# EasyEDA Pro project RM2025_超级电容控制器_IMCA.eprj, board 超电V2.3_1
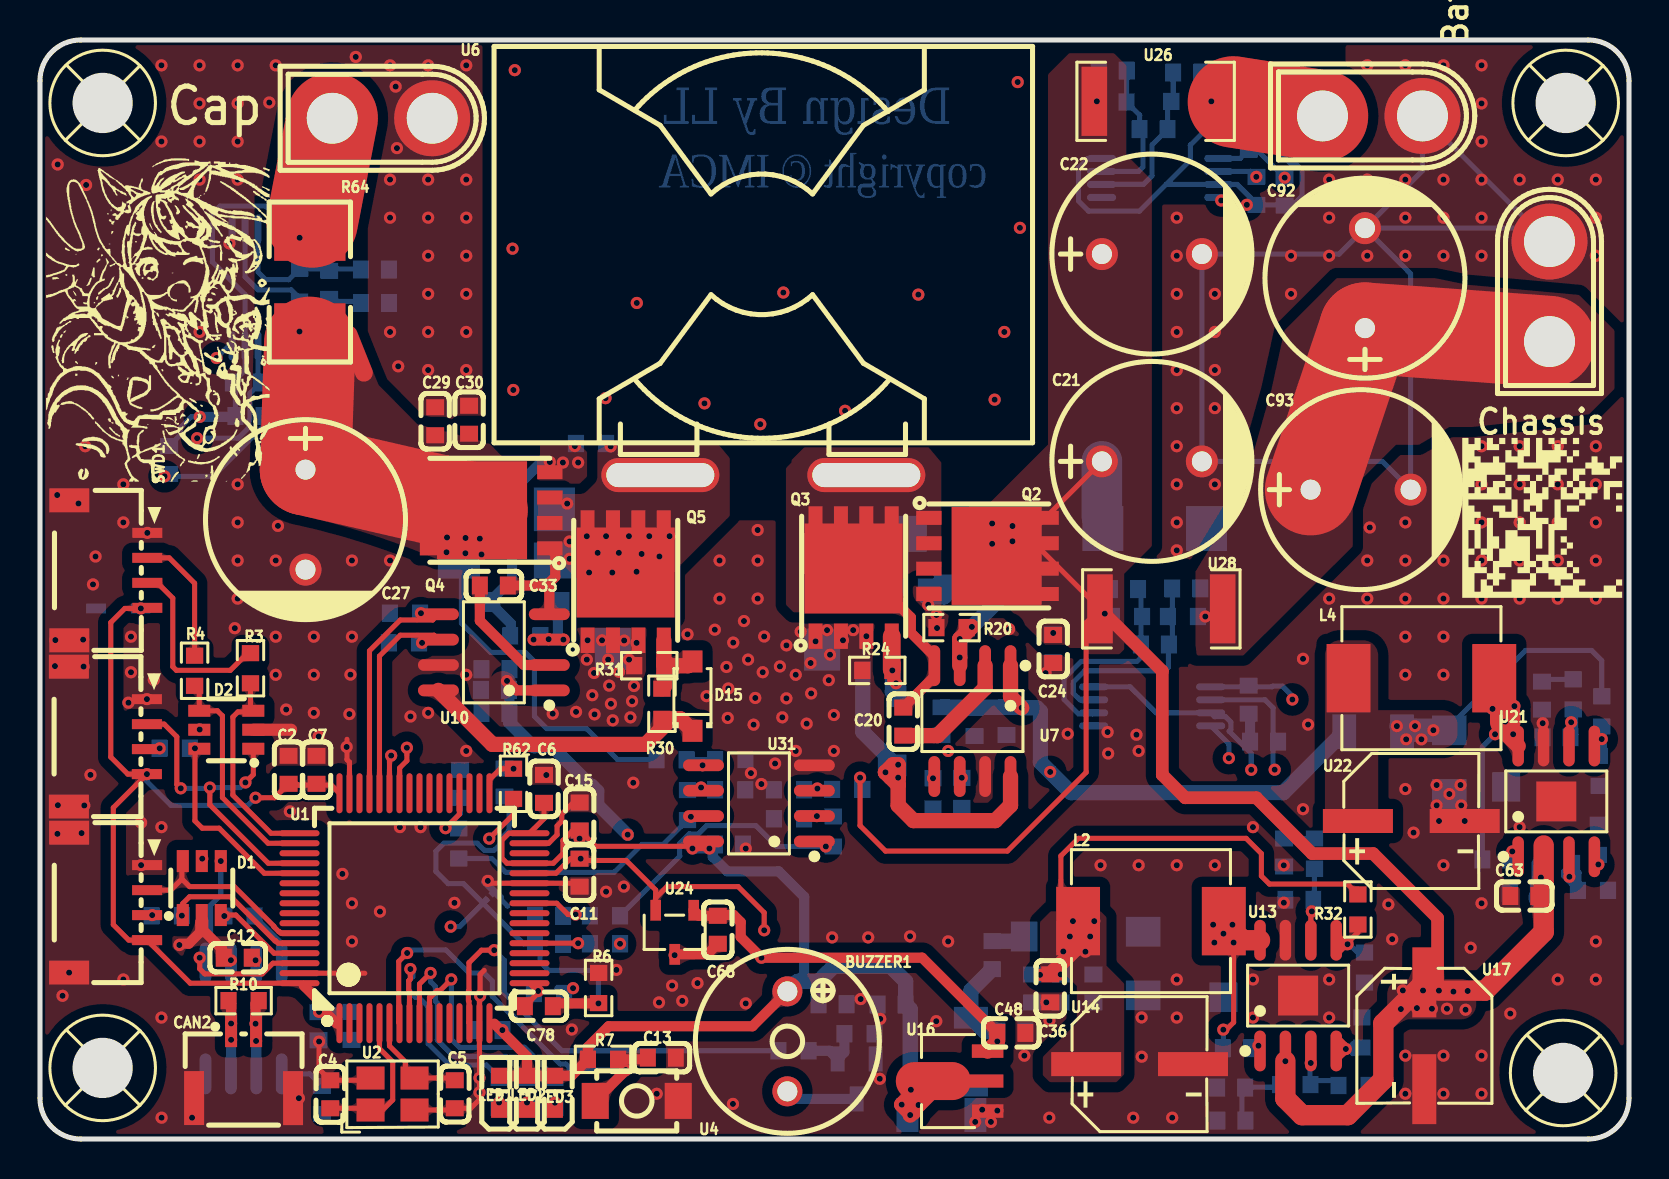
[diagram p5: board, top side]
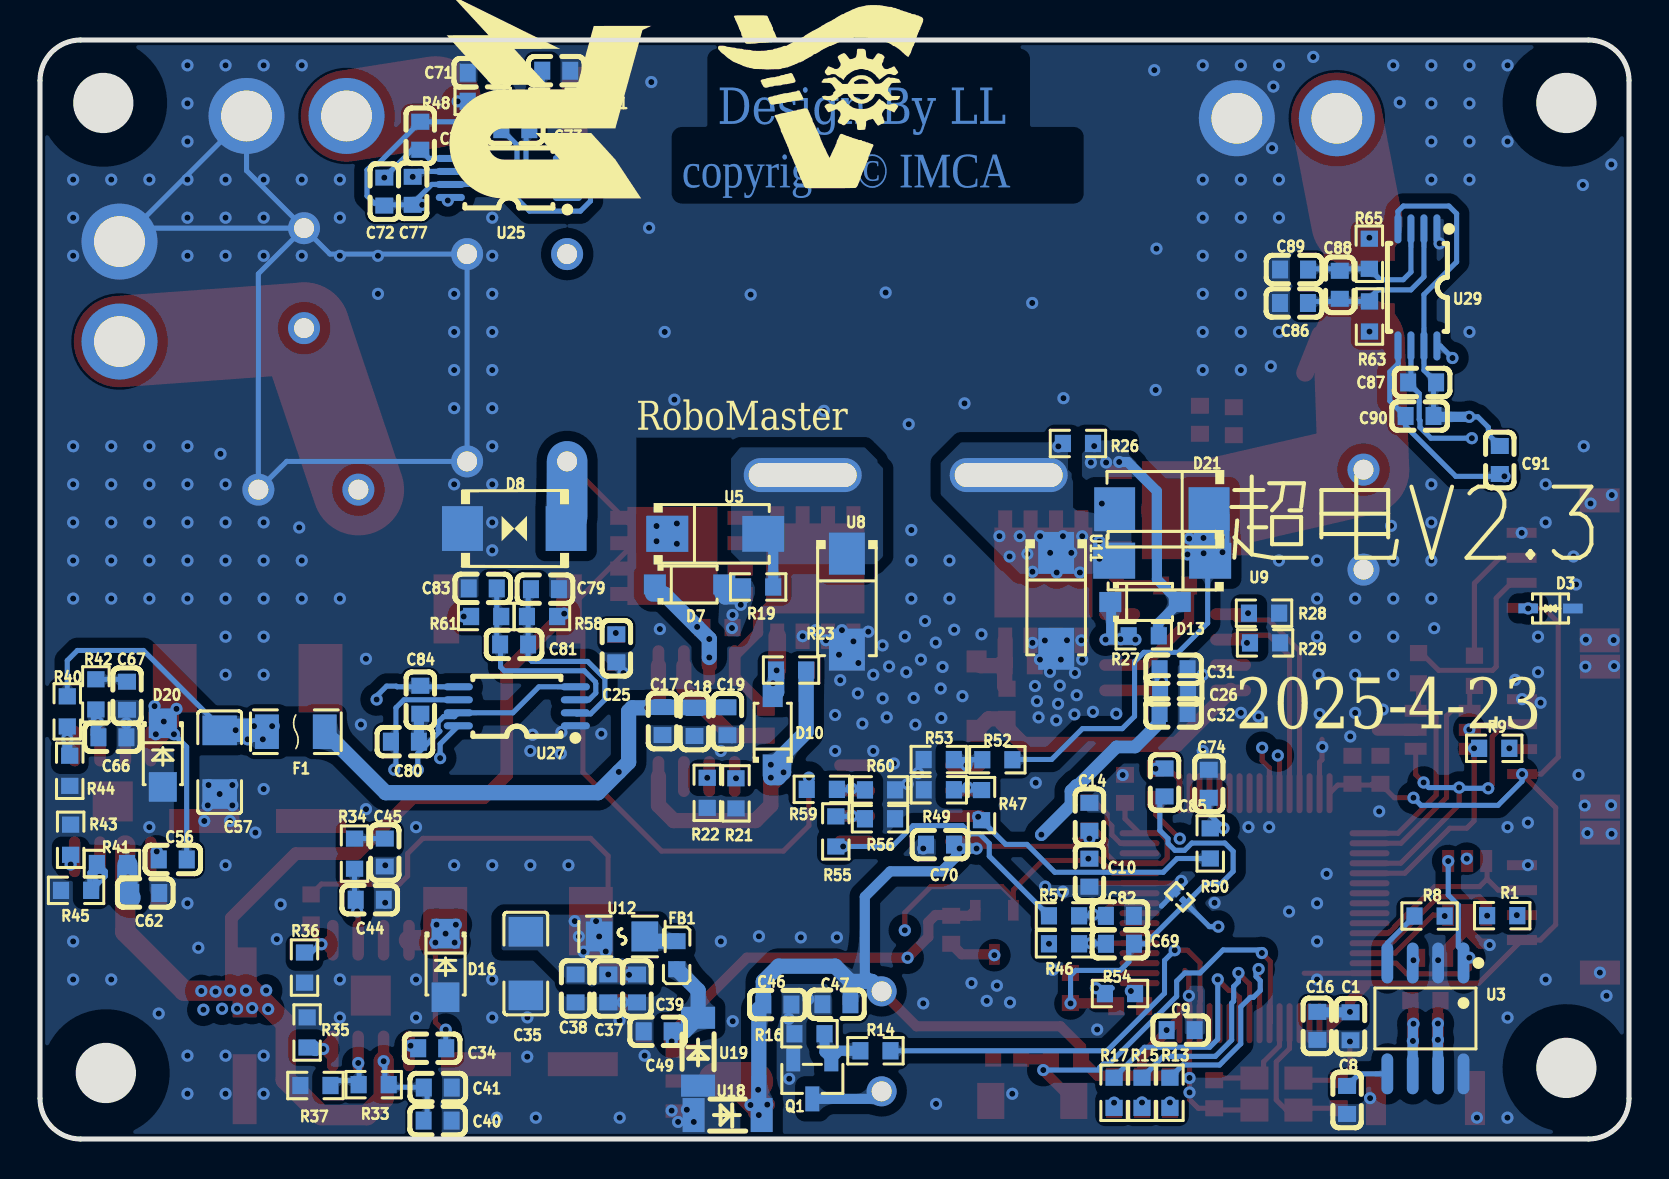
[diagram p6: board, bottom side, seen from below]

Outline 79.45 x 54.97 mm; copper layers: Top Layer, Inner1, Inner2, Bottom Layer. Coordinates in mm from the lower left corner of the outline.
Outline path: 0,52.93 0,2.03 arc(0.6,0.6) 2.03,0 77.42,0 arc(78.86,0.6) 79.45,2.03 79.45,52.93 arc(78.86,54.37) 77.42,54.97 2.03,54.97 arc(0.6,54.37) 0,52.93
Stack: Top Layer 0.035mm 外层铜厚1oz / Dielectric1 0.2104mm 7628 RC49% 8.6mil / Inner1 0.0152mm 内层铜厚 / Dielectric2 1.065mm 1.1mm H/HOZ Copper / Inner2 0.0152mm 内层铜厚 / Dielectric3 0.2104mm 7628 RC49% 8.6mil / Bottom Layer 0.035mm 外层铜厚1oz

## Design rules (mm)
template: 自定义配置
spacing safeClearance (default): track to track 0.152, other pairs 0.152 to 0.3
track width trackWidth (default): min 0.102, default 0.254, max 254
differential pair differentialPair (default): width min 0.127, default 0.254, max 2.54; gap min 0.152, default 0.152
via viaSize (default): diameter min 0.5, default 0.61, max 10; hole min 0.249, default 0.305, max 5.999

## Placement (name value [footprint] x y rotation side)
Battery  XT30U-M  [CONN-TH_XT30U-M]  66.62 51.17 0 top
BUZZER1  -  [BUZ-TH_BD9.0-P5.00-D0.6-L-FD]  37.37 4.88 270 top
C1  100nF  [C0603]  13.92 5.64 90 bottom
C2  100nF  [C0603]  12.43 18.47 270 top
C4  10pF  [C0603]  14.52 2.24 90 top
C5  10pF  [C0603]  20.74 2.24 270 top
C6  100nF  [C0603]  25.2 17.51 270 top
C7  100nF  [C0603]  13.83 18.47 270 top
C8  100nF  [C0603]  14.1 1.95 270 bottom
C9  100nF  [C0603]  22.42 5.45 0 bottom
C10  1uF  [C0603]  26.98 13.32 270 bottom
C11  100nF  [C0603]  26.98 13.32 270 top
C12  100nF  [C0603]  9.89 9.07 0 top
C13  100nF  [C0603]  31.09 4.07 180 top
C14  1uF  [C0603]  26.98 16.11 90 bottom
C15  100nF  [C0603]  26.98 16.13 90 top
C16  100nF  [C0603]  15.58 5.66 90 bottom
C17  10uF  [C0603]  48.33 20.9 90 bottom
C18  1uF  [C0603]  46.73 20.86 90 bottom
C19  100nF  [C0603]  45.08 20.89 90 bottom
C20  100nF  [C0603]  43.16 20.88 270 top
C21  50V 470uF  [CAP-TH_BD10.0-P5.00-D0.6-FD-A]  55.6 33.89 0 top
C22  50V 470uF  [CAP-TH_BD10.0-P5.00-D0.6-FD-A]  55.6 44.26 0 top
C24  10uF  [C0603]  50.66 24.51 90 top
C25  10uF  [C0603]  50.63 24.54 90 bottom
C26  10uF  [C0603]  22.75 22.46 0 bottom
C27  50V 470uF  [CAP-TH_BD10.0-P5.00-D0.6-FD-A]  13.28 30.98 270 top
C29  10uF  [C0603]  19.76 35.9 270 top
C30  10uF  [C0603]  21.45 35.97 270 top
C31  1uF  [C0603]  22.77 23.49 0 bottom
C32  100nF  [C0603]  22.77 21.31 0 bottom
C33  100nF  [C0603]  22.69 27.68 180 top
C34  100nF  [C0603]  59.84 4.54 180 bottom
C35  -  [C1206]  55.16 8.77 90 bottom
C36  10uF  [C0603]  50.51 7.53 90 top
C37  1uF  [C0603]  51.04 7.53 90 bottom
C38  2.2uF  [C0603]  52.67 7.53 90 bottom
C39  100nF  [C0603]  49.6 7.53 90 bottom
C40  10uF  [C0603]  59.57 0.92 0 bottom
C41  1uF  [C0603]  59.56 2.57 0 bottom
C44  47pF  [C0603]  62.97 11.97 0 bottom
C45  4700pF=4.7nF  [C0603]  62.21 14.33 90 bottom
C46  100nF  [C0603]  42.58 6.72 0 bottom
C47  1uF  [C0603]  39.63 6.74 180 bottom
C48  100nF  [C0603]  48.57 5.31 180 top
C49  10uF  [C0603]  48.57 5.39 180 bottom
C56  100nF  [C0603]  72.82 13.98 180 bottom
C57  -  [C1206]  70.47 18.85 90 bottom
C62  10uF  [C0603]  74.19 12.3 0 bottom
C63  1uF  [C0603]  74.22 12.15 0 top
C66  47pF  [C0603]  75.83 20.09 0 bottom
C67  4700pF=4.7nF  [C0603]  75.1 22.17 90 bottom
C68  100nF  [C0603]  33.89 10.46 90 top
C69  NC  [C0603]  25.45 9.76 180 bottom
C70  100nF  [C0603]  34.45 14.72 180 bottom
C71  NC  [C0603]  57.36 53.33 0 bottom
C72  100nF  [C0603]  60.82 47.42 270 bottom
C73  NC  [C0603]  55.69 50.51 0 bottom
C74  1nF  [C0603]  21.01 17.77 270 bottom
C75  NC  [C0603]  53.64 53.43 0 bottom
C76  100nF  [C0603]  60.44 50.18 270 bottom
C77  100nF  [C0603]  62.24 47.38 90 bottom
C78  NC  [C0603]  24.94 6.64 0 top
C79  NC  [C0603]  54.2 27.5 180 bottom
C80  100nF  [C0603]  61.21 19.87 180 bottom
C81  NC  [C0603]  55.75 24.73 180 bottom
C82  1nF  [C0603]  25.46 11.16 0 bottom
C83  NC  [C0603]  57.31 27.54 180 bottom
C84  100nF  [C0603]  60.44 21.97 90 bottom
C85  NC  [C0603]  23.22 17.83 270 bottom
C86  NC  [C0603]  16.75 41.81 0 bottom
C87  100nF  [C0603]  10.34 37.84 180 bottom
C88  NC  [C0603]  14.46 42.72 270 bottom
C89  NC  [C0603]  16.75 43.48 180 bottom
C90  100nF  [C0603]  10.47 36.16 0 bottom
C91  100nF  [C0603]  6.46 33.96 270 bottom
C92  50V 470uF  [CAP-TH_BD10.0-P5.00-D0.6-FD-A]  66.25 43.05 90 top
C93  50V 470uF  [CAP-TH_BD10.0-P5.00-D0.6-FD-A]  66.03 32.48 0 top
CAN2  -  [CONN-SMD_2P-P1.25_GH1.25-2P]  10.18 3.74 0 top
Cap  XT30U-M  [CONN-TH_XT30U-M]  17.11 51.05 0 top
Chassis  XT30U-M  [CONN-TH_XT30U-M]  75.48 42.38 90 top
D1  SRV05-4HTG-D  [SOT-23-6_L2.9-W1.6-P0.95-LS2.8-BR]  8.09 12.55 270 top
D2  SRV05-4HTG-D  [SOT-23-6_L2.9-W1.6-P0.95-LS2.8-BR]  9.32 20.47 0 top
D3  -  [SOD-323_L1.8-W1.3-LS2.5-BI]  3.92 26.53 0 bottom
D7  1N4148W  [SOD-123F_L2.7-W1.6-LS3.8-RD]  46.97 27.74 180 bottom
D8  SMBJ28CA  [SMB_L4.6-W3.6-LS5.3-BI]  55.74 30.53 180 bottom
D10  1N4148W  [SOD-123F_L2.7-W1.6-LS3.8-RD]  42.82 20.42 90 bottom
D13  1N4148W  [SOD-123F_L2.7-W1.6-LS3.8-RD]  24.2 26.86 180 bottom
D15  1N4148W  [SOD-123F_L2.7-W1.6-LS3.8-RD]  32.62 22.15 90 top
D16  DSK36  [SOD-123FL_L2.8-W1.8-LS3.7-R-RD]  59.17 8.68 270 bottom
D20  DSK36  [SOD-123FL_L2.8-W1.8-LS3.7-R-RD]  73.31 19.2 270 bottom
D21  SMBJ36A  [SMB_L4.6-W3.6-LS5.3-RD]  23.36 31.5 0 bottom
F1  BSMD1206-035-16V  [F1206]  66.66 20.37 180 bottom
FB1  GZ1608D601TF  [L0603]  47.61 9.19 90 bottom
GH1  U1  [CONN-SMD_4P-P2.00_GH1.25-WS-4P]  3.41 11.82 270 top
GH2  U3  [CONN-SMD_4P-P2.00_GH1.25-WS-4P]  3.4 20.12 270 top
L2  10uH  [IND-SMD_L7.8-W7.0_MAPM0630F]  55.55 10.9 0 top
L4  10uH  [IND-SMD_L7.8-W7.0_MAPM0630F]  69.07 23.05 0 top
LED1  -  [LED0603-R-RD]  22.95 2.31 90 top
LED2  -  [LED0603-R-RD]  24.35 2.31 90 top
LED3  -  [LED0603-R-RD]  25.75 2.31 90 top
M1  M3  [M3_cut_out]  3.13 51.82 0 top
M2  M3  [M3_cut_out]  76.29 51.82 0 top
M3  M3  [M3_cut_out]  3.13 3.56 0 top
M4  M3  [M3_cut_out]  76.16 3.3 0 top
Q1  -  [SOT-23-3_L2.9-W1.3-P1.90-LS2.4-BR]  40.83 3.01 90 bottom
Q2  CSD18540Q5B  [VSON-CLIP-8_L5.0-W6.0-P1.27-BL]  47.44 29.16 270 top
Q3  CSD18540Q5B  [VSON-CLIP-8_L5.0-W6.0-P1.27-BL]  40.68 28.15 0 top
Q4  CSD18540Q5B  [VSON-CLIP-8_L5.0-W6.0-P1.27-BL]  22.49 31.45 90 top
Q5  CSD18540Q5B  [VSON-CLIP-8_L5.0-W6.0-P1.27-BL]  29.29 27.94 0 top
R1  33Ω  [R0603]  6.34 11.17 0 bottom
R3  100Ω  [R0603]  10.52 23.55 270 top
R4  100Ω  [R0603]  7.73 23.42 270 top
R6  0  [R0603]  27.93 7.55 270 top
R7  10kΩ  [R0603]  28.15 3.98 180 top
R8  33Ω  [R0603]  9.97 11.15 180 bottom
R9  33Ω  [R0603]  6.74 19.54 0 bottom
R10  120Ω  [R0603]  10.18 6.92 0 top
R13  1kΩ  [R0603]  22.95 2.31 90 bottom
R14  510Ω  [R0603]  37.68 4.41 0 bottom
R15  1kΩ  [R0603]  24.35 2.31 90 bottom
R16  4.7kΩ  [R0603]  40.98 5.26 180 bottom
R17  1kΩ  [R0603]  25.75 2.31 90 bottom
R19  10K  [R0603]  43.54 27.61 180 bottom
R20  10R  [R0603]  45.58 25.58 180 top
R21  10K  [R0603]  44.65 17.29 270 bottom
R22  10K  [R0603]  46.09 17.31 270 bottom
R23  10R  [R0603]  41.9 23.45 0 bottom
R24  10K  [R0603]  41.87 23.44 0 top
R26  10K  [R0603]  27.55 34.79 0 bottom
R27  10R  [R0603]  24.26 25.17 180 bottom
R28  10K  [R0603]  18.25 26.3 180 bottom
R29  10K  [R0603]  18.2 24.81 180 bottom
R30  10R  [R0603]  31.1 21.77 90 top
R31  10K  [R0603]  30.46 23.67 0 top
R32  50K  [R0603]  65.9 11.48 90 top
R33  588K  [R0603]  62.77 2.72 180 bottom
R34  16.9K  [R0603]  63.72 14.27 270 bottom
R35  100K  [R0603]  66.1 5.33 270 bottom
R36  10K  [R0603]  66.23 8.58 90 bottom
R37  132.7K  [R0603]  65.68 2.68 180 bottom
R40  120K  [R0603]  78.09 21.39 90 bottom
R41  588K  [R0603]  75.85 13.78 180 bottom
R42  16.9K  [R0603]  76.66 22.24 270 bottom
R43  100K  [R0603]  77.92 14.97 270 bottom
R44  10K  [R0603]  77.97 18.42 90 bottom
R45  61.3K  [R0603]  77.65 12.44 180 bottom
R46  47R  [R0603]  28.25 9.76 180 bottom
R47  3K 0.1%  [R0603]  32.37 16.7 270 bottom
R48  5.1R  [R0603]  57.32 51.9 180 bottom
R49  30K 0.1%  [R0603]  34.51 17.47 180 bottom
R50  47R  [R0603]  20.94 14.78 90 bottom
R51  5.1R  [R0603]  53.58 51.86 0 bottom
R52  30K 0.1%  [R0603]  31.58 18.97 0 bottom
R53  3K 0.1%  [R0603]  34.51 18.98 180 bottom
R54  47R  [R0603]  25.45 7.28 180 bottom
R55  3K 0.1%  [R0603]  39.66 15.38 270 bottom
R56  30K 0.1%  [R0603]  37.45 16.02 0 bottom
R57  47R  [R0603]  28.25 11.16 180 bottom
R58  5.1R  [R0603]  54.35 26.13 0 bottom
R59  30K 0.1%  [R0603]  40.36 17.49 180 bottom
R60  3K 0.1%  [R0603]  37.45 17.46 0 bottom
R61  5.1R  [R0603]  57.14 26.13 180 bottom
R62  47R  [R0603]  23.68 17.77 90 top
R63  5.1R  [R0603]  12.98 41.14 90 bottom
R64  2mΩ  [RES-SMD_L6.3-W3.3_HOLR2512]  13.49 42.86 270 top
R65  5.1R  [R0603]  12.98 44.27 270 bottom
R66  0  [R0201]  22.47 12.12 225 bottom
SWD1  -  [CONN-SMD_4P-P2.00_GH1.25-WS-4P]  3.42 28.44 270 top
U1  STM32G474RBT6  [LQFP-64_L10.0-W10.0-P0.50-LS12.0-BL]  18.72 11.54 0 top
U2  -  [CRYSTAL-SMD_4P-L3.2-W2.5-BL-2]  17.63 2.25 0 top
U3  TJA1057T,118  [SOIC-8_L4.9-W3.9-P1.27-LS6.0-BL]  10.18 6.03 0 bottom
U4  -  [SW-SMD_L4.0-W3.0-LS4.8-1]  29.84 1.91 180 top
U5  SS56  [SMA_L4.2-W2.6-LS5.1-RD]  45.69 30.27 180 bottom
U6  22uH  [PQ2620_LL]  36.17 33.2 0 top
U7  UCC27282DR  [SOIC-8_L4.9-W3.9-P1.27-LS6.0-BL]  46.62 20.9 180 top
U8  SS56  [SMA_L4.2-W2.6-LS5.1-RD]  39.11 26.88 270 bottom
U9  SS56  [SMA_L4.2-W2.6-LS5.1-RD]  23.34 28.92 0 bottom
U10  UCC27282DR  [SOIC-8_L4.9-W3.9-P1.27-LS6.0-BL]  22.69 24.34 90 top
U11  SS56  [SMA_L4.2-W2.6-LS5.1-RD]  28.64 26.92 270 bottom
U12  SMD0805-200 1.1A 2.2A 6V  [F0805]  50.35 10.13 180 bottom
U13  TPS54560DDAR/TPS54360  [SOIC-8_L5.0-W4.0-P1.27-LS6.0-BL-EP2.0]  62.91 7.17 0 top
U14  10V 470uF  [CAP-SMD_BD6.3-L6.6-W6.6-LS7.2-FD]  54.98 3.75 0 top
U16  -  [SOT-89-3_L4.5-W2.5-P1.50-LS4.2-BR]  46.03 2.9 0 top
U17  50V 47uF  [CAP-SMD_BD6.3-L6.6-W6.6-LS7.2-FD]  69.22 5.16 270 top
U18  LC-LL-34 3.6V  [LL-34_L3.5-W1.5-RD]  45.07 1.2 0 bottom
U19  LC-LL-34 5.1V  [LL-34_L3.5-W1.5-RD]  46.55 4.37 270 bottom
U21  TPS54560DDAR/TPS54360  [SOIC-8_L5.0-W4.0-P1.27-LS6.0-BL-EP2.0]  75.81 16.89 0 top
U22  16V 220uf  [CAP-SMD_BD6.3-L6.6-W6.6-LS7.2-FD]  68.57 15.9 0 top
U24  REF3033AIDBZR  [SOT-23-3_L3.0-W1.7-P0.95-LS2.9-BR]  31.73 10.34 90 top
U25  INA240A1PWR  [TSSOP-8_L4.4-W3.0-P0.65-LS6.4-BL]  56.01 48.07 90 bottom
U26  0R010/1%3W/R2512  [R2512]  55.78 51.9 0 top
U27  INA240A1PWR  [TSSOP-8_L4.4-W3.0-P0.65-LS6.4-BL]  55.61 21.64 90 bottom
U28  0R005/1%3W/R2512  [R2512]  56.07 26.51 180 top
U29  INA240A1PWR  [TSSOP-8_L4.4-W3.0-P0.65-LS6.4-BL]  10.58 42.59 0 bottom
U31  OPA2365AIDR  [SOIC-8_L4.9-W3.9-P1.27-LS6.0-BL]  35.95 16.79 90 top

## Footprints (pads in the part's own frame, mm; a bottom-side part is the same pattern mirrored in y, then rotated)
BUZ-TH_BD9.0-P5.00-D0.6-L-FD
  round 1.5 hole 1: 1(-2.5,0) 2(2.5,0)
C0603
  rect 0.8x0.9 smd: 1(-0.7,0) 2(0.7,0)
C1206
  rect 1.485x1.728 smd: 1(-1.593,0) 2(1.593,0)
CAP-SMD_BD6.3-L6.6-W6.6-LS7.2-FD
  rect 3.5x1.2 smd: 1(-2.67,0) 2(2.67,0)
CAP-TH_BD10.0-P5.00-D0.6-FD-A
  round 1.6 hole 1: 1(-2.5,0) 2(2.5,0)
CONN-SMD_2P-P1.25_GH1.25-2P
  rect 0.6x1.7 smd: 1(-0.625,1.702) 2(0.625,1.702)
  rect 1.001x2.7 smd: 3(2.474,-1.702) 4(-2.474,-1.696)
CONN-SMD_4P-P2.00_GH1.25-WS-4P
  rect 0.5x1.5 smd: 1(-1.875,1.95) 2(-0.625,1.95) 3(0.625,1.95) 4(1.875,1.95)
  rect 1.2x2 smd: 5(3.5,-1.95) 6(-3.5,-1.95)
CONN-TH_XT30U-M
  round 3.8 hole 2.54: 1(-2.5,0) 2(2.5,0)
CRYSTAL-SMD_4P-L3.2-W2.5-BL-2
  rect 1.399x1.151 smd: 1(-1.1,-0.8) 2(1.1,-0.8) 3(1.1,0.8) 4(-1.1,0.8)
F0805
  rect 1.335x1.5 smd: 1(-1.143,0) 2(1.143,0)
F1206
  rect 1.19x1.728 smd: 1(-1.445,0) 2(1.445,0)
IND-SMD_L7.8-W7.0_MAPM0630F
  rect 2.194x3.42 smd: 1(3.643,0) 2(-3.643,0)
L0603
  rect 0.8x0.864 smd: 1(-0.7,0) 2(0.7,0)
LED0603-R-RD
  rect 0.8x0.8 smd: 1(0.851,0) 2(-0.851,0)
LL-34_L3.5-W1.5-RD
  rect 1.1x1.7 smd: 1(-1.7,0) 2(1.7,0)
LQFP-64_L10.0-W10.0-P0.50-LS12.0-BL
  oval 0.3x2 smd: 1(-3.75,-5.75) 2(-3.25,-5.75) 3(-2.75,-5.75) 4(-2.25,-5.75) 5(-1.75,-5.75) 6(-1.25,-5.75) 7(-0.75,-5.75) 8(-0.25,-5.75) 9(0.25,-5.75) 10(0.75,-5.75) 11(1.25,-5.75) 12(1.75,-5.75) 13(2.25,-5.75) 14(2.75,-5.75) 15(3.25,-5.75) 16(3.75,-5.75) 33(3.75,5.75) 34(3.25,5.75) 35(2.75,5.75) 36(2.25,5.75) 37(1.75,5.75) 38(1.25,5.75) 39(0.75,5.75) 40(0.25,5.75) 41(-0.25,5.75) 42(-0.75,5.75) 43(-1.25,5.75) 44(-1.75,5.75) 45(-2.25,5.75) 46(-2.75,5.75) 47(-3.25,5.75) 48(-3.75,5.75)
  oval 2x0.3 smd: 17(5.75,-3.75) 18(5.75,-3.25) 19(5.75,-2.75) 20(5.75,-2.25) 21(5.75,-1.75) 22(5.75,-1.25) 23(5.75,-0.75) 24(5.75,-0.25) 25(5.75,0.25) 26(5.75,0.75) 27(5.75,1.25) 28(5.75,1.75) 29(5.75,2.25) 30(5.75,2.75) 31(5.75,3.25) 32(5.75,3.75) 49(-5.75,3.75) 50(-5.75,3.25) 51(-5.75,2.75) 52(-5.75,2.25) 53(-5.75,1.75) 54(-5.75,1.25) 55(-5.75,0.75) 56(-5.75,0.25) 57(-5.75,-0.25) 58(-5.75,-0.75) 59(-5.75,-1.25) 60(-5.75,-1.75) 61(-5.75,-2.25) 62(-5.75,-2.75) 63(-5.75,-3.25) 64(-5.75,-3.75)
PQ2620_LL
  oval 5.9x1.7 hole 5.4x1.2: 1(-5.15,0) 2(5.15,0)
R0201
  rect 0.303x0.324 smd: 1(-0.241,0) 2(0.241,0)
R0603
  rect 0.807x0.864 smd: 1(-0.754,0) 2(0.754,0)
R2512
  rect 1.282x3.456 smd: 1(-3.067,0) 2(3.067,0)
RES-SMD_L6.3-W3.3_HOLR2512
  rect 2.7x3.564 smd: 1(-2.413,0) 2(2.413,0)
SMA_L4.2-W2.6-LS5.1-RD
  rect 2.1x1.8 smd: 1(-2.4,0) 2(2.4,0)
SMB_L4.6-W3.6-LS5.3-BI
  rect 2.047x2.241 smd: 1(-2.591,0) 2(2.591,0)
SMB_L4.6-W3.6-LS5.3-RD
  rect 2.047x2.192 smd: 1(-2.361,0) 2(2.361,0)
SOD-123F_L2.7-W1.6-LS3.8-RD
  rect 1.1x1 smd: 1(-1.735,0) 2(1.735,0)
SOD-123FL_L2.8-W1.8-LS3.7-R-RD
  rect 1.48x1.4 smd: 1(1.59,0) 2(-1.59,0)
SOD-323_L1.8-W1.3-LS2.5-BI
  rect 0.986x0.49 smd: 1(-1.117,0) 2(1.117,0)
SOIC-8_L4.9-W3.9-P1.27-LS6.0-BL
  oval 0.588x2.045 smd: 1(-1.905,-2.772) 2(-0.635,-2.772) 3(0.635,-2.772) 4(1.905,-2.772) 5(1.905,2.772) 6(0.635,2.772) 7(-0.635,2.772) 8(-1.905,2.772)
SOIC-8_L5.0-W4.0-P1.27-LS6.0-BL-EP2.0
  oval 0.574x2.038 smd: 1(-1.905,-2.769) 2(-0.635,-2.769) 3(0.635,-2.769) 4(1.905,-2.769) 5(1.905,2.769) 6(0.635,2.769) 7(-0.635,2.769) 8(-1.905,2.769)
  rect 2x2 smd: 9(0,0)
SOT-23-3_L2.9-W1.3-P1.90-LS2.4-BR
  rect 1.25x0.7 smd: 1(1,-0.95) 2(1,0.95) 3(-1,0)
SOT-23-3_L3.0-W1.7-P0.95-LS2.9-BR
  rect 1.038x0.532 smd: 1(1.101,-0.95) 2(1.101,0.95) 3(-1.101,0)
SOT-23-6_L2.9-W1.6-P0.95-LS2.8-BR
  rect 1.1x0.6 smd: 1(1.35,-0.95) 2(1.35,0) 3(1.35,0.95) 4(-1.35,0.95) 5(-1.35,0) 6(-1.35,-0.95)
SOT-89-3_L4.5-W2.5-P1.50-LS4.2-BR
  rect 1.575x0.672 smd: 1(1.356,-1.5) 3(1.356,1.5)
  custom 5.377x1.9 smd: 2(-1.356,0)
SW-SMD_L4.0-W3.0-LS4.8-1
  rect 1.351x1.801 smd: 1(-2.075,0) 2(2.075,0)
TSSOP-8_L4.4-W3.0-P0.65-LS6.4-BL
  oval 0.353x1.454 smd: 1(-0.975,-2.927) 2(-0.325,-2.927) 3(0.325,-2.927) 4(0.975,-2.927) 5(0.975,2.927) 6(0.325,2.927) 7(-0.325,2.927) 8(-0.975,2.927)
VSON-CLIP-8_L5.0-W6.0-P1.27-BL
  rect 0.7x1.27 smd: 1(-1.904,-3) 2(-0.636,-3) 3(0.636,-3) 4(1.906,-3)
  rect 0.7x1 smd: 5(1.904,3) 6(0.634,3) 7(-0.636,3) 8(-1.906,3)
  rect 4.9x4.5 smd: 8(-0.001,0.39)

## Nets
As in the schematic, except:
CAP_B: Cap.1 R64.1 R65.1
CAP_FRONT: C27.1 C29.2 C30.2 D21.1 Q4.5 Q4.6 Q4.7 Q4.8 R52.1 R63.1 R64.2 U9.1
CHASSIS_CURRENT: C92.1 C93.1 Chassis.1 R61.1 U28.1
TIMER_A1: R21.1 U1.42 U7.5
TIMER_A2: R22.1 U1.43 U7.6
TIMER_B1: R29.1 U1.44 U10.6
TIMER_B2: R28.1 U1.45 U10.5

Pads without a net: U1 2 3 4 11 12 13 18 19 20 22 23 24 26 30 35 37 38 39 40 41 46 51 54 55 56 57 58; U25 1

## Via types
v1: diameter 0.61, hole 0.305, Top Layer to Bottom Layer, 527 vias

## Routing (per net, layer and track width the routed paths; a pad name or vN(x,y) marks a point on that pad's centre or on a via; arc(x,y) is an arc through that point)
12V: length 64.6
  Top Layer w0.508: U10.1 23.83,22.44 v1(23.35,22.91)
  Top Layer w0.762: U7.1 48.53,22.12 v1(49.09,21.57)
  Inner1 w0.635: v1(29.38,15.22) 29.38,15.1 31.1,13.39 33.55,13.39 33.83,13.66 45.81,13.66 v1(50.51,18.36)
  Bottom Layer w0.508: C32.2 23.47,23.49
  Bottom Layer w0.635: C32.2 23.47,20.84 24.7,19.61 25.62,19.61 27.55,17.68 27.62,17.68 27.9,17.41 27.9,16.71 v1(29.38,15.22)
  Bottom Layer w0.762: C19.2 48.34,21.59 ; 48.34,21.59 C17.2 ; 48.34,21.59 49.06,21.59 v1(49.09,21.57) 49.84,21.57 50.02,21.39 50.02,18.85 v1(50.51,18.36) 51.55,17.32 62.17,17.32 F1.2
24V: length 100.8
  Top Layer w0.254: 47.83,29.16 48.37,29.16 48.59,29.39 ; v1(41,18.07) 41,15.67 42.27,14.4 48.37,14.4 52.31,18.34 52.31,25.82 U28.2 50.13,29.39 48.59,29.39 ; 48.59,29.39 C21.1
  Top Layer w0.635: 69.88,7.34 69.88,11.05 66.66,14.27 63.61,14.27 60.82,17.07 57.26,17.07 56.12,18.21 56.12,23.4 v1(53.24,26.28) U28.2
  Top Layer w1.016: v1(62.27,3.89) 62.27,2.03 63.1,1.19 65.39,1.19 67.17,2.97 67.17,5.78 U17.1 ; 75.19,14.68 75.19,10.36 72.25,7.42 v1(69.95,7.42)
  Bottom Layer w0.254: 60.1,0.8 60.1,2.4 60.28,2.59 61.77,2.59 62.21,3.03 62.21,3.61 62.42,3.82
  Bottom Layer w1.016: 75.08,13.72 75.08,12.22 74.93,12.07
  Bottom Layer w2.032: 53.1,31.14 C21.1
  vias: v1(47.61,30.78) v1(47.61,29.77) v1(48.62,30.66) v1(48.62,29.9) v1(50.66,25.31) v1(52.84,51.9) v1(68.04,6.5) v1(68.14,7.43) v1(68.85,6.55) v1(69.15,7.43) v1(69.6,6.52) v1(70.35,6.52) v1(70.67,7.37) v1(71.28,6.47) v1(71.39,7.4) v1(75.05,13.08)
+3.3V: length 238.4
  Top Layer w0.254: v1(26.98,15.02) 26.98,15.39 27,15.41 ; 27,15.41 C15.1 26.64,15.43 26.15,14.93 26.15,14.27 25.66,13.79 23.35,13.79 23.1,14.05 23.1,14.94 23.45,15.29 24.47,15.29 25.2,16.02 C6.2 ; 27,15.41 27.78,14.64 32.51,14.64 v1(32.62,14.53) v1(33.47,14.53) ; v1(5.04,26.53) 4.24,26.53 3.54,25.83 3.54,19.1 4.39,18.25 v1(5.35,18.25) 3.67,16.57 3.67,10.72 4.44,9.95 GH1.4 7.51,7.79 U1.64 ; 14.41,6.36 14.25,6.36 ; U1.48 14.57,17.7 12.88,17.7 12.82,17.77 C2.2 11.73,17.07 v1(10.78,17.07)
  Top Layer w0.508: 13.19,7.67 13.95,6.91 v1(13.95,6.36) 14.25,6.36 14.84,5.77 ; LED2.1 LED3.1 26.58,3.16 R7.2 27.4,4.6 28.43,5.64 35.62,5.64 BUZZER1.1 ; LED2.1 LED1.1 ; LED2.1 24.35,4.13 22.72,5.77
  Top Layer w0.762: v1(43.51,1.2) 43.51,1.3 v1(43.09,1.72) 44.26,2.9 U16.2 44.67,2.45 v1(43.93,1.7) 43.67,1.45 43.67,1.32
  Inner1 w0.254: BUZZER1.1 37.37,10.13 38.19,10.95 47.09,10.95 52.58,16.43 60.56,16.43 62.62,18.49 v1(62.62,21.98) 62.21,22.39 62.21,29.34 61.38,30.17 61.38,47.23 v1(62.24,48.08) ; v1(23.12,5.45) 23.12,6.87 6.23,23.76 v1(6.23,33.14)
  Inner1 w0.762: v1(13.95,6.36) 14.5,6.91 21.07,6.91 22.53,5.45 v1(23.12,5.45)
  Bottom Layer w0.254: 11.17,36.01 11.17,35.65 8.66,33.14 v1(6.23,33.14) ; 11.17,36.01 11.06,35.91 ; 11.17,36.01 11.17,36.13 ; U29.5 11.54,39.65 11.54,38.79 11.96,38.37 11.96,36.92 11.17,36.13 ; v1(10.78,17.07) 10.4,16.69 6.55,16.69 5.35,17.89 v1(5.35,18.25) ; C90.2 11.17,36.13 ; v1(62.24,48.08) 60.84,49.48 C76.2 60.01,49.04 58.94,49.04 ; U27.5 61.6,22.62 61.64,22.65 62.12,22.65 62.62,22.15 v1(62.62,21.98)
  Bottom Layer w0.508: C16.2 15.56,6.34 C1.2 ; 37.87,7.88 38.21,8.23 38.21,12.12 36.94,13.39 34.37,13.39 33.64,14.12 33.64,14.61 C70.2 33.67,14.72 v1(33.47,14.53) v1(32.62,14.53)
  Bottom Layer w0.762: 38.93,7.88 39.69,8.64 42.52,8.64 43.28,7.88 C46.2 43.51,6.5 v1(43.51,1.2) ; 38.93,7.88 C47.2 ; 38.93,7.88 37.87,7.88 BUZZER1.1
  vias: v1(43.54,2.46)
+5V: length 70.5
  Top Layer w0.508: U24.1 32.96,11.16 C68.2 33.93,11.2 34.68,11.2 35.04,10.85 35.04,10.1 v1(36.07,9.07) 44.11,9.07 C48.2
  Top Layer w0.762: C48.2 v1(47.87,4.88) U16.3
  Inner1 w0.254: v1(10.78,8.94) 10.78,9.32 10.14,9.96 8.8,9.96 8.11,10.65 v1(8.11,14.02) 9.25,15.16 9.25,20.02 8.73,20.55 7.86,20.55
  Inner1 w0.762: v1(36.07,9.07) 31.88,4.88 27.42,4.88 26.65,4.11 15.73,4.11 15.1,3.48 13.1,3.48 12.56,4.02 12.56,7.16 v1(10.78,8.94)
  Bottom Layer w0.762: C49.2 47.23,5.39 U19.1 46.55,7.43 FB1.1
  vias: v1(7.98,20.48)
AGND: length 192.1
  Top Layer w0.508: v1(27.92,6.78) 25.78,6.78 C78.2 ; C68.1 33.36,9.24 U24.3
  Inner1 w0.508: v1(7.99,36.12) 7.54,36.12 6.99,35.57 6.99,23.88 24.6,6.27 27.42,6.27 v1(27.92,6.78) 29.32,6.78 v1(31.73,9.19) 34.32,11.79 36.73,11.79 36.93,11.98 46.58,11.98 52.07,17.47 59.81,17.47 60.56,18.22 v1(60.56,18.47) 61.11,19.02 61.11,28.98 60.35,29.74 60.35,46.72 v1(60.34,46.72)
  Bottom Layer w0.254: v1(27.92,6.78) 27.92,8.18 27.67,8.43 25.44,8.43 25.01,8.86 25.01,9.51 C69.2 24.18,9.76 22.15,11.79 ; 22.15,11.79 20.98,10.62 20.49,10.62 ; 22.15,11.79 22.32,11.96 ; 22.15,11.79 21.17,12.77 20.41,12.77 19.8,13.39 19.8,14.39 20.21,14.8 21.86,14.8 22.22,14.44 22.7,14.44 23.05,14.78 23.05,15.03 23.46,15.44 23.46,16.9 C85.2 ; 56.31,47.74 57.51,48.95 57.51,49.71 58.68,50.88 C76.1 62.55,48.76 62.8,48.76 63.1,48.46 63.1,47.17 62.74,46.81 62.36,46.81 C77.1 62.2,46.72 C72.2 ; 56.31,47.74 59.86,47.74 60.61,46.99 60.61,46.51 ; 56.31,47.74 54.97,46.41 52.43,46.41 51.93,46.91 51.93,48.56 52.4,49.04 53.08,49.04 ; C90.1 9.77,37.71 C87.2 10.25,38.45 U29.7 10.25,42.23 8.62,43.87 8.62,46.28 9,46.66 11.29,46.66 11.55,46.39 U29.4 ; v1(60.56,18.47) 60.56,19.29 59.46,20.39 59.54,20.48 59.54,20.85 59.28,21.12 58.73,21.12 U27.7 55.81,21.32 54.51,22.62 U27.4 ; v1(7.99,36.12) 7.56,36.12 7.03,35.59 7.03,35.23 C91.1
  Bottom Layer w0.508: C80.2 60.51,21.2 C84.1 ; C90.1 9.73,36.12 v1(7.99,36.12)
  vias: v1(20.54,10.62)
GND: length 106.8
  Top Layer w0.254: U1.63 16.24,8.29 ; v1(22.39,12.91) 22.51,12.79 26.81,12.79 C11.2 ; v1(13.95,4.88) 13.95,3.5 C4.2 16.42,2.94 U2.4 ; U1.47 15.47,18.85 15.35,18.97 15.35,19.99 ; C15.2 26.67,16.83 26.09,16.25 26.09,15.89 25.86,15.66 25.86,15.22 25.43,14.79 24.47,14.79 ; 22.21,8.43 22.01,8.23 v1(22.01,7.16) 21.97,7.13 U1.15 v1(21.97,3.05) v1(21.97,2.33) 21.97,1.98 21.54,1.54 C5.2 20.65,1.45 U2.2
  Top Layer w0.508: 6.98,9.77 7.44,9.77 8.01,10.34 8.01,10.85 ; 9.12,9.16 9.12,9.48 8.16,10.44 8.16,10.95
  Top Layer w0.61: 10.67,20.47 12.56,20.47
  Bottom Layer w0.254: C92.2 64.95,44.26 C22.2 C21.2 67.12,33.89 C93.2 68.53,43.27 C92.2 ; C92.2 69.12,48.43 Battery.2 74.74,45.55 ; C92.2 74.74,45.55 ; 74.74,45.55 75.41,44.88 Chassis.2 74.81,45.55 74.74,45.55 ; 23.07,12.1 22.43,12.74 22.43,12.91 ; 22.18,12.85 23.38,11.65 23.38,11.65
  vias: v1(0.77,24.95) v1(0.75,23.65) v1(0.86,32.21) v1(0.87,15.26) v1(0.88,48.74) v1(0.89,16.7) v1(1.13,7.16) v1(1.46,8.32) v1(1.92,31.78) v1(2.16,24.97) v1(2.08,15.3) v1(2.26,34.65) v1(2.18,23.63) v1(2.22,16.68) v1(2.31,47.71) v1(2.52,18.21) v1(2.65,27.74) v1(2.78,29.13) v1(4.17,32.74) v1(4.17,30.84) v1(4.17,7.98) v1(4.42,21.82) v1(4.55,25.12) v1(4.55,23.34) v1(5.06,15.82) v1(5.06,13.7) v1(5.37,30.31) v1(5.35,22) v1(5.69,22.96) v1(6.07,53.7) v1(6.07,49.89) v1(6.07,15.6) v1(6.07,6.07) v1(6.08,1.07) v1(6.97,9.7) v1(7.6,1.07) v1(7.98,53.7) v1(7.98,51.79) v1(7.98,49.89) v1(7.98,47.98) v1(7.98,40.36) v1(9.47,44.79) v1(9.55,8.94) v1(9.74,25.55) v1(9.88,53.7) v1(9.88,51.79) v1(9.88,49.89) v1(9.88,47.98) v1(9.88,32.74) v1(9.88,30.84) v1(9.88,28.93) v1(9.88,27.03) v1(11.46,51.84) v1(11.79,53.7) v1(11.79,28.93) v1(11.79,27.03) v1(11.79,25.12) v1(11.79,23.22) v1(11.9,30.67) v1(12.31,21.48) v1(12.49,16.38) v1(12.95,2.04) v1(13.69,27.03) v1(13.69,25.12) v1(13.69,23.22) v1(13.69,21.31) v1(13.94,20.13) v1(15.12,13.26) v1(15.33,19.61) v1(15.47,21.25) v1(15.52,23.23) v1(15.6,28.93) v1(15.6,27.03) v1(15.6,25.12) v1(15.6,11.79) v1(15.6,9.88) v1(15.6,7.98) v1(15.79,54.12) v1(17,11.37) v1(17.5,53.7) v1(17.5,47.98) v1(17.5,46.08) v1(17.5,40.36) v1(17.5,28.93) v1(17.78,52.63) v1(17.85,49.56) v1(17.91,38.65) v1(17.99,15.6) v1(18.53,21.13) v1(19.03,15.6) v1(19.41,53.7) v1(19.41,47.98) v1(19.41,46.08) v1(19.41,44.17) v1(19.41,42.27) v1(19.41,40.36) v1(19.41,38.46) v1(19.41,21.31) v1(20.72,11.81) v1(21.31,53.7) v1(21.31,47.98) v1(21.31,46.08) v1(21.31,44.17) v1(21.31,42.27) v1(21.31,40.36) v1(21.31,38.46) v1(21.31,23.22) v1(21.31,19.41) v1(23.63,44.53) v1(23.67,37.46) v1(23.74,53.46) v1(25.32,18.2) v1(25.64,21.27) v1(26.59,5.48) v1(26.8,21.36) v1(27.34,23.98) v1(27.38,24.94) v1(27.62,22.2) v1(27.7,23.31) v1(27.73,21.24) v1(28.1,24.94) v1(28.28,37.05) v1(28.3,12.37) v1(28.41,23.98) v1(28.46,22.68) v1(28.55,21.77) v1(28.64,20.94) v1(28.82,8.46) v1(28.95,23.37) v1(29.21,24.93) v1(29.19,12.62) v1(29.45,23.98) v1(29.52,21.09) v1(29.61,21.9) v1(29.66,17.82) v1(29.7,22.66) v1(29.84,41.81) v1(29.83,24.82) v1(30.84,2.26) v1(30.95,6.83) v1(31.61,7.67) v1(32.11,6.91) v1(32.38,25.24) v1(32.88,7.8) v1(33.23,36.79) v1(33.33,22.15) v1(33.74,25.47) v1(33.98,28.93) v1(33.98,27.03) v1(34.32,23.61) v1(34.42,22.53) v1(34.39,21.06) v1(34.66,24.83) v1(34.65,1.75) v1(35.2,25.91) v1(35.29,14.53) v1(35.29,6.78) v1(35.41,23.98) v1(35.55,18.3) v1(35.76,22.06) v1(35.68,20.72) v1(35.88,30.46) v1(35.88,28.93) v1(35.88,27.03) v1(36.01,35.75) v1(36.07,17.75) v1(36.14,23.34) v1(36.21,25.13) v1(36.75,18.78) v1(37,23.63) v1(37.17,42.33) v1(37.12,21.09) v1(37.32,24.69) v1(37.32,22.04) v1(37.79,23.22) v1(37.79,19.41) v1(38.04,25.37) v1(38.33,20.77) v1(38.53,23.81) v1(38.56,22.28) v1(38.78,24.89) v1(39.35,25.45) v1(39.44,22.95) v1(39.5,24.22) v1(39.61,10.08) v1(39.7,21.21) v1(39.69,19.41) v1(40.15,24.94) v1(40.26,36.42) v1(40.66,25.45) v1(41.03,7) v1(41.32,25.15) v1(41.41,10.08) v1(42.01,6.01) v1(41.99,3.01) v1(43.5,10.14) v1(43.92,42.23) v1(44.81,5.89) v1(45.41,19.41) v1(45.41,9.88) v1(46.76,0.85) v1(47.11,1.47) v1(47.55,0.85) v1(47.73,36.98) v1(47.87,1.42) v1(48.22,40.36) v1(48.46,25.5) v1(48.89,52.86) v1(49,45.57) v1(49.22,4.17) v1(50.28,23.3) v1(50.32,6.83) v1(50.47,1.07) v1(50.47,5.93) v1(51.38,20.27) v1(53.03,13.69) v1(53.38,20.35) v1(53.41,19.28) v1(54.66,1.07) v1(54.82,20.22) v1(54.93,19.41) v1(54.93,13.69) v1(55.08,6.08) v1(55.09,4.12) v1(56.61,1.07) v1(56.84,46.08) v1(56.84,44.17) v1(56.84,42.27) v1(56.84,40.36) v1(56.84,38.46) v1(56.84,36.55) v1(56.84,34.65) v1(56.84,32.74) v1(56.84,30.84) v1(56.84,29.44) v1(56.84,13.69) v1(56.84,7.98) v1(56.84,6.07) v1(58.74,42.27) v1(58.74,40.36) v1(58.74,38.46) v1(58.74,36.55) v1(58.74,32.74) v1(58.74,13.69) v1(60.65,15.6) v1(60.65,7.98) v1(60.65,6.07) v1(62.19,13.69) v1(62.19,11.82) v1(62.55,44.17) v1(62.55,42.27) v1(63.15,24.02) v1(63.15,16.5) v1(63.41,20.73) v1(64.46,47.98) v1(64.46,46.08) v1(64.46,44.17) v1(64.46,27.03) v1(64.46,7.98) v1(64.46,6.07) v1(66.36,53.7) v1(66.36,47.98) v1(66.36,44.17) v1(66.36,28.93) v1(66.36,27.03) v1(66.49,30.58) v1(67.42,11.73) v1(67.61,10) v1(68.27,53.7) v1(68.27,47.98) v1(68.27,46.08) v1(68.27,44.17) v1(68.27,30.84) v1(68.27,28.93) v1(68.27,27.03) v1(68.27,25.12) v1(68.27,23.22) v1(68.27,17.5) v1(68.27,4.17) v1(68.27,2.26) v1(68.68,15.32) v1(69.83,17.7) v1(69.83,16.69) v1(69.95,15.9) v1(70.17,53.7) v1(70.17,47.98) v1(70.17,46.08) v1(70.17,44.17) v1(70.17,32.74) v1(70.17,30.84) v1(70.17,28.93) v1(70.17,27.03) v1(70.17,25.12) v1(70.17,23.22) v1(70.17,13.69) v1(70.17,4.17) v1(70.17,2.26) v1(70.43,34.27) v1(70.47,17.25) v1(71.03,17.7) v1(71.06,16.69) v1(71.24,15.9) v1(71.53,9.57) v1(72.08,53.7) v1(72.08,51.79) v1(72.08,49.89) v1(72.08,47.98) v1(72.08,46.08) v1(72.08,44.17) v1(72.08,34.65) v1(72.08,32.74) v1(72.08,30.84) v1(72.08,28.93) v1(72.08,27.03) v1(72.08,11.79) v1(72.08,4.17) v1(72.08,2.26) v1(73.52,6.27) v1(73.98,47.98) v1(73.98,34.65) v1(73.98,32.74) v1(73.98,30.84) v1(73.98,28.93) v1(73.98,27.03) v1(73.98,15.6) v1(75.14,20.8) v1(75.89,47.98) v1(75.89,34.65) v1(75.89,32.74) v1(75.89,30.84) v1(75.89,28.93) v1(75.89,27.03) v1(75.89,7.98) v1(77.79,47.98) v1(77.79,46.08) v1(77.79,44.17) v1(77.79,34.65) v1(77.79,32.74) v1(77.79,30.84) v1(77.79,28.93) v1(77.79,27.03) v1(77.79,9.88) v1(77.79,7.98)
$BUZZER1_2: length 3.6
  Bottom Layer w0.508: BUZZER1.2 37.75,2.01 Q1.3
$C8_1: length 2.3
  Bottom Layer w0.254: U3.5 13.49,3.26 C8.1
$C20_1: length 12.4
  Top Layer w0.508: Q3.8 41.09,28.54 43.54,26.09 43.54,25.32 44.72,24.15 U7.4 44.72,23.13 C20.1
  Bottom Layer w0.508: U5.2 42.79,29.77 R19.2
$C20_2: length 6.2
  Top Layer w0.762: U7.2 47.26,22.56 44.87,20.18 C20.2
$C33_1: length 5.7
  Top Layer w0.508: 25.47,27.82 25.76,28.12 25.76,29.27 25.49,29.54 ; 25.47,27.82 U10.4 ; 25.47,27.82 25.33,27.68 C33.1
  vias: v1(26.36,31.78) v1(26.48,29.89) v1(26.48,29.02) v1(27.34,30.15) v1(27.45,28.33) v1(27.88,29.32) v1(28.3,30.15) v1(28.53,34.64) v1(28.62,28.33) v1(28.94,29.32) v1(29.45,30.15) v1(29.83,28.37) v1(30.08,29.26) v1(30.46,30.15) v1(30.97,29.13) v1(31.48,30.15)
$C33_2: length 6.2
  Top Layer w0.508: C33.2 21.99,25.92 24.21,23.71 U10.2
$C34_1:
  vias: v1(60.92,4.67)
$C34_2: length 7.9
  Top Layer w0.254: v1(59.68,9.82) 59.68,5.83 59.24,5.39 v1(59.17,5.47)
  Top Layer w1.016: L2.1 60.15,9.94 U13.8
  Bottom Layer w0.254: C34.2 59.17,4.56 v1(59.17,5.47)
  vias: v1(58.66,10.72) v1(58.72,9.82) v1(59.17,10.27) v1(59.62,10.72)
$C35_2: length 23.9
  Top Layer w0.254: R32.2 65.38,12.75 61.47,12.75 61.07,13.15 61.07,14.27 60.31,15.04 51.92,15.04 51.04,14.16 51.04,11.76 L2.2
  Top Layer w0.762: C36.2 51.91,9.63 L2.2
  vias: v1(50,8.21) v1(51.04,8.23) v1(51.16,9.38) v1(51.49,10.13) v1(51.65,10.9) v1(52.27,9.37) v1(52.51,10.13) v1(52.71,10.9)
$C44_2: length 3
  Top Layer w0.254: v1(63.59,11.39) 63.54,11.34 U13.6
  Bottom Layer w0.254: C44.2 63.72,12.03 R34.2
$C45_2: length 1.5
  Bottom Layer w0.254: C45.2 R34.1
$C56_1:
  vias: v1(73.62,14.38)
$C56_2: length 8.4
  Top Layer w0.762: v1(73.26,20.88) 73.26,20.3 U21.8
  Top Layer w1.524: v1(73.26,20.88) 73.26,21.26
  Bottom Layer w0.254: v1(72.75,20.24) 72.12,19.61 72.12,13.99 C56.2
  vias: v1(72.63,21.51) v1(73.66,20.24) v1(73.72,21.65)
$C57_2: length 15.4
  Bottom Layer w0.254: 70.76,20.65 70.76,20.92 74.28,24.43 77.58,24.43 78.09,23.93 R40.2
  Bottom Layer w0.508: 68.4,19.99 68.51,20.11 69.62,20.11
  Bottom Layer w0.762: v1(67.84,20.65) v1(68.75,20.65) 70.76,20.65 70.88,20.77
  vias: v1(68.31,19.99) v1(69.07,19.99) v1(69.67,20.45)
$C66_2: length 1.4
  Bottom Layer w0.508: C66.2 76.66,20.22 R42.2
  vias: v1(76.56,20.84)
$C67_2: length 1.6
  Bottom Layer w0.254: C67.2 75.22,22.99 R42.1
$C71_1: length 8.3
  Bottom Layer w0.254: C71.1 56.66,51.99 R48.2 56.38,51.72 C73.2 55.6,49.73 55.6,48.18 55.18,47.75 53.09,47.75 53.08,47.74
$C73_1: length 7.3
  Bottom Layer w0.254: U25.3 54.93,48.39 55.15,48.61 55.15,50.34 C73.1 54.98,51.21 R51.2 54.34,51.87 C75.2
$C79_1: length 10.6
  Bottom Layer w0.254: C79.1 55.05,27.36 C81.2 55.05,24.08 54.85,23.89 52.06,23.89 51.21,23.03 51.21,21.98 51.93,21.26 52.63,21.26 U27.2
$C81_1: length 10.8
  Bottom Layer w0.254: U27.3 52,21.97 51.66,22.3 51.66,22.78 51.68,22.79 51.68,22.86 52.24,23.42 56.24,23.42 56.42,23.6 56.42,24.71 C81.1 56.61,24.9 C83.2
$C86_1: length 8.8
  Bottom Layer w0.254: U29.2 10.25,43.12 10.91,42.47 12.56,42.47 12.98,42.05 R63.2 15.97,41.89 C86.1
$C88_1: length 7.7
  Bottom Layer w0.254: U29.3 10.9,43.36 11.29,42.98 12.44,42.98 R65.2 16.01,43.52 C89.2
$CAN2_1: length 4.5
  Top Layer w0.508: v1(9.55,4.96) CAN2.1 v1(9.55,5.78) 9.55,6.79 R10.1
  Bottom Layer w0.508: v1(9.55,5.78) v1(9.55,4.96) 9.55,3.27 U3.7
$CAN2_2: length 4.3
  Top Layer w0.508: 10.8,5.45 v1(10.8,4.9) ; v1(10.78,5.77) 10.78,6.76 R10.2
  Bottom Layer w0.508: v1(10.78,5.77) 10.8,5.74 v1(10.8,4.9) 10.81,4.89 U3.6
$D7_1: length 6.9
  Top Layer w0.762: v1(46.59,25.61) v1(45.99,25.01) v1(45.99,24.08) U7.3
  Bottom Layer w0.762: 48.82,27.26 48.24,27.26 v1(46.59,25.61) v1(45.99,25.01) v1(45.99,24.08)
$D7_2: length 1.1
  Bottom Layer w0.762: 44.3,27.11 45.2,27.11 45.35,27.26
  vias: v1(44.41,26.72) v1(44.82,26.21) v1(44.85,25.56)
$D10_1: length 19.9
  Top Layer w0.762: 42.91,17.7 v1(42.91,18.07) ; 42.91,17.7 42.91,16.69 43.67,15.93 47.76,15.93 48.53,16.69 48.53,18.13 ; 42.91,17.7 v1(42.27,18.34) ; v1(42.91,18.07) 42.64,18.34 v1(42.27,18.34) ; v1(42.91,18.07) v1(42.91,18.72) 42.66,18.72 v1(42.27,18.34)
  Bottom Layer w0.762: 42.27,19.23 v1(42.27,18.34) 42.54,18.07 v1(42.91,18.07) v1(42.91,18.72) ; 42.27,19.23 41.14,20.36 R23.1 ; 42.27,19.23 D10.1
$D10_2: length 3.8
  Top Layer w0.508: v1(42.8,22.79) 42.62,22.98 v1(42.62,23.44)
  Top Layer w0.889: Q3.4 42.59,23.47
  Bottom Layer w0.762: D10.2 42.62,22.35 v1(42.62,23.44)
$D13_1: length 3.5
  Bottom Layer w0.508: 25.67,24.98 v1(24.68,24.98) ; 25.67,24.98 25.89,25.2 25.89,26.81 D13.1 ; 25.67,24.98 v1(26.17,24.98)
  vias: v1(25.43,25)
$D13_2: length 10.8
  Bottom Layer w0.508: v1(25.49,33.86) 25.07,33.86 23.61,32.4 23.61,28 22.47,26.86 23.54,25.78 23.54,25
  vias: v1(26.15,33.83) v1(26.74,34.66) v1(26.91,33.83)
$D15_1: length 14.8
  Top Layer w0.762: U10.8 22.62,19.74 30.28,19.74 31.35,20.81 ; D15.1 32.02,21.01 R30.1
$D15_2: length 4
  Top Layer w0.762: R31.2 32.41,23.67 D15.2 ; R31.2 31.19,23.7 Q5.4 ; R31.2 31.22,22.64 R30.2
$FB1_2: length 1.7
  Bottom Layer w0.762: U12.2 48.97,9.89 FB1.2
$GH1_3:
  vias: v1(5.61,11.2)
$GH2_3:
  vias: v1(5.98,19.54)
$LED1_2:
  vias: v1(22.95,1.83)
$LED2_2:
  vias: v1(24.35,1.83)
$LED3_2:
  vias: v1(25.75,1.82)
$Q1_1: length 3
  Bottom Layer w0.508: R16.2 40.22,4.35 Q1.1 39.48,4.41 R14.2
$R3_1: length 9.4
  Top Layer w0.254: R3.1 10.38,24.3 9.52,23.44 6.82,23.44 6.64,23.62 6.64,27.05 5.8,27.89 5.44,27.89 SWD1.3
$R4_1: length 6.5
  Top Layer w0.254: R4.1 7.73,27.8 6.46,29.06 SWD1.2
$R8_1: length 2.9
  Bottom Layer w0.254: R8.1 12.08,9.79 U3.4
$R32_1: length 2.9
  Top Layer w0.254: 65.05,9.45 65.05,9.45 65.32,9.72 ; 65.32,9.76 65.9,10.34 R32.1 ; 65.32,9.76 65.42,9.76 ; 65.32,9.76 65.06,10.03
  Bottom Layer w0.254: 66.22,9.22 65.99,9.22 65.57,9.64
  vias: v1(65.38,9.74)
$R33_1: length 2.7
  Bottom Layer w0.254: 63.57,3.87 63.5,3.79 63.5,2.61 ; 63.65,2.92 64.72,2.92 64.96,2.69
  vias: v1(63.54,3.8)
$R35_2: length 2.8
  Top Layer w0.254: 64.91,3.99 65.22,4.31 65.22,4.39 ; 65.25,4.47 65.25,4.73 65.01,4.97 ; 65.07,4.44 64.84,4.44 64.82,4.45
  Bottom Layer w0.254: 65.35,4.61 65.49,4.61 65.69,4.81 ; 65.52,4.39 65.63,4.28 65.74,4.28 ; 65.4,4.5 65.92,4.5 66.04,4.63
  vias: v1(65.29,4.5)
$R40_1: length 1.5
  Bottom Layer w0.508: R44.2 78.09,19.29 v1(78.09,20) R40.1
$R41_1: length 4.2
  Bottom Layer w0.254: 76.61,12.72 76.18,13.15 76.18,13.39 76.57,13.78 R41.1 76.61,13.37 76.71,13.26 ; 76.61,12.72 R45.2 76.96,12.5 76.96,13.33 76.78,13.33 76.71,13.26 ; 76.61,12.72 76.71,12.83 76.71,13.26
  vias: v1(76.47,13.12)
$R43_2:
  vias: v1(77.92,13.73)
$R46_1: length 62.9
  Inner1 w0.254: 29.07,9.7 31.99,12.62 33.3,12.62 33.4,12.72 33.8,12.72 34.09,13.02 46.16,13.02 51.64,18.5 57.68,18.5 59.04,19.86 59.8,19.86 60.44,20.51 60.44,28.82 59.76,29.5 59.76,46.24 v1(59.06,46.94)
  vias: v1(29,9.76)
$R47_1: length 1.4
  Bottom Layer w0.254: R47.1 33.74,17.45 R49.2
  vias: v1(33.05,17.58)
$R47_2: length 12.8
  Bottom Layer w0.254: R50.1 22.6,14.03 23.29,13.34 28.71,13.34 30.1,14.73 31.16,14.73 32.37,15.95
  vias: v1(32.54,16.12)
$R52_2: length 2.3
  Bottom Layer w0.254: v1(33.13,18.69) 32.85,18.97 R52.2 32.34,18.98 R53.2
$R54_1: length 40.8
  Inner1 w0.254: v1(26.65,7.54) 28.87,7.54 33.59,12.27 33.98,12.27 34.28,12.56 46.34,12.56 51.83,18.05 59.13,18.05 59.44,18.36 v1(59.44,19.05)
  Bottom Layer w0.254: 25.84,7.54 v1(26.65,7.54) ; U27.8 59.44,19.76 v1(59.44,19.05)
$R55_1: length 1.5
  Bottom Layer w0.254: R56.2 38.32,16.14 R55.1
  vias: v1(38.84,16.15)
$R55_2: length 13.3
  Bottom Layer w0.254: R55.2 v1(39.29,14.63) 36.84,14.63 35.8,15.67 33.33,15.67 32.92,15.26 32.47,15.26 31.99,14.78 31.99,14.15 R57.1
$R59_2: length 1.4
  Bottom Layer w0.254: R59.2 39.58,17.46 R60.2
  vias: v1(38.87,17.53)
$R62_1: length 36.3
  Top Layer w0.254: v1(22.46,15.02) 23.68,16.24 R62.1
  Inner1 w0.254: v1(22.46,15.02) 22.22,14.78 17.75,14.78 8.83,23.7 v1(8.83,39.06)
  Bottom Layer w0.254: U29.8 9.43,39.66 v1(8.83,39.06)
ADC3_IN1: length 3.9
  Top Layer w0.254: 24.47,11.79 25.83,11.79 26.4,11.23 v1(26.78,11.23)
  Bottom Layer w0.254: C82.2 R57.2
ADC4_IN4: length 3.9
  Top Layer w0.254: v1(20.28,15.54) 20.97,16.24 U1.36
  Bottom Layer w0.254: v1(20.28,15.54) 21.01,16.28 C74.2
BAT: length 4.5
  Top Layer w4.572: Battery.1 59.67,51.87
  vias: v1(58.57,51.9)
BUZZ: length 21.8
  Top Layer w0.254: U1.14 21.45,5.82 21.45,6.89 21.42,6.92 21.42,7.4 21.45,7.43 21.45,8.82 22.08,9.44 v1(22.71,9.44)
  Bottom Layer w0.254: v1(22.71,9.44) 23.23,8.93 23.23,7.29 26.1,4.41 R14.1
CAN1_RX: length 4.7
  Top Layer w0.254: D1.3 9.79,11.2 11.7,9.29 U1.61
  vias: v1(9.22,11.15)
CAN1_TX: length 11.1
  Top Layer w0.254: v1(7.98,9.07) 7.98,8.51 8.24,8.26 11.11,8.26 11.65,8.79 U1.62
  Bottom Layer w0.254: v1(7.98,9.07) 8.53,9.62 8.53,11.7 9.04,12.21 v1(9.04,13.9)
CAP_B: length 5.3
  Top Layer w4.572: Cap.1 13.61,45.87
  vias: v1(12.98,45.07)
CAP_FRONT: length 37.3
  Top Layer w0.889: 16.2,38.32 15.43,40.23
  Top Layer w4.572: 22.1,31.45 C27.1 13.49,39.84
  Bottom Layer w0.254: 21.07,29.17 21.07,25.8 22.53,24.34 24.26,24.34 24.72,23.87 24.72,21.14 25.34,20.52 27.33,20.52 28.87,18.98 30.86,18.98
  Bottom Layer w1.778: 20.97,29 20.87,29.1 20.87,31.24
  vias: v1(12.98,40.38) v1(20.35,30.09) v1(20.33,29.35) v1(21.27,29.3) v1(21.28,30.06) v1(21.99,30.03) v1(22.08,29.24)
CHASSIS_CURRENT: length 17.8
  Top Layer w4.572: C93.1 C92.1 Chassis.1
  vias: v1(58.27,26.13)
CLK: length 11.5
  Top Layer w0.254: U1.50 11.4,14.79 9.12,17.07 9.12,21.16 8.87,21.42 D2.4 7.97,22.43 R4.2
DIO: length 10.6
  Top Layer w0.254: R3.2 10.52,21.56 ; 10.52,21.56 10.67,21.42 ; 10.52,21.56 10.52,21.36 9.9,21.36 9.64,21.11 9.64,17.2 11.55,15.29 U1.49
LED1: length 11.4
  Top Layer w0.254: v1(18.52,8.5) 18.52,8.01 18.47,7.96 18.47,7.95 18.44,7.91 18.44,7.43 18.47,7.39 U1.8
  Bottom Layer w0.254: v1(18.52,8.5) 18.65,8.37 18.65,8.12 18.44,7.91 18.44,7.43 18.78,7.09 18.93,7.09 19.41,6.61 19.41,4.76 20.47,3.7 22.32,3.7 R13.2
LED2: length 11.5
  Top Layer w0.254: U1.9 18.97,7.75 v1(19.53,8.31)
  Bottom Layer w0.254: R15.2 23.28,4.13 20.68,4.13 19.87,4.95 19.87,6.8 19.77,6.89 19.77,7.63 19.53,7.87 v1(19.53,8.31)
LED3: length 11.7
  Top Layer w0.254: U1.10 19.47,7.09 19.52,7.09 19.86,7.43 20.01,7.43 v1(20.56,7.98)
  Bottom Layer w0.254: v1(20.56,7.98) 20.56,4.99 20.97,4.59 24.23,4.59 R17.2
OPAMP1_VINP: length 1.6
  Top Layer w0.254: 24.47,7.79 24.86,7.4 v1(24.91,7.4) 24.91,7.31 C78.1
OPAMP2_VINP: length 3.8
  Top Layer w0.254: 24.47,9.79 v1(26.91,9.79)
  Bottom Layer w0.254: C69.1 R46.2
OPAMP4_VINP: length 2.1
  Top Layer w0.254: v1(23.68,18.52) 23.02,18.52 22.47,17.97 U1.33
OSC_IN: length 7.5
  Top Layer w0.254: C4.1 16.44,1.54 U2.1 17.13,1.45 17.64,1.96 17.64,3.86 16.97,4.52 U1.5
OSC_OUT: length 5.3
  Top Layer w0.254: U1.6 17.47,4.66 18.27,3.86 18.27,3.48 18.7,3.05 U2.3 20.63,3.05 C5.1
RESET: length 21.4
  Top Layer w0.254: v1(18.36,9.3) 17.94,8.88 17.94,5.83 U1.7
  Top Layer w0.508: C13.2 30.31,3.98 R7.1 ; 27.76,1.91 29.29,3.43 v1(29.29,3.45)
  Bottom Layer w0.254: v1(29.29,3.45) 26.46,3.45 26.46,3.59 26.3,3.75 26,3.75 23.8,5.95 23.8,6.01 23.63,6.18 23.58,6.18 22.62,7.13 22.62,7.9 22.21,8.31 21.45,8.31 20.3,9.45 18.51,9.45 v1(18.36,9.3)
TIMER_A1: length 30.4
  Top Layer w0.254: v1(18.34,19.57) 18.34,18.92 17.98,18.56 17.98,18.16 17.97,18.16 U1.42
  Inner1 w0.381: v1(44.65,18.04) 43.45,16.84 21.07,16.84 v1(18.34,19.57)
TIMER_A2: length 33.1
  Top Layer w0.254: U1.43 17.47,19.09 v1(17.56,19.18)
  Inner1 w0.381: v1(17.56,19.18) 20.56,16.18 31.15,16.18 31.94,15.39 43.29,15.39 45.96,18.07 v1(46.09,18.07)
TIMER_B1: length 10.3
  Top Layer w0.254: U10.6 19.7,25.2 18.02,25.2 16.97,24.15 U1.44
  vias: v1(19.1,24.81)
TIMER_B2: length 11.3
  Top Layer w0.254: U1.45 16.47,24.42 18.02,25.96 19.63,25.96 U10.5
  vias: v1(19.05,26.3)
U1_RX: length 7.5
  Top Layer w0.254: U1.60 11.9,9.79 11.79,9.91 11.75,9.91 9.54,12.12 7.48,12.12 7.14,11.78 D1.1
  vias: v1(7.09,11.17)
U1_TX: length 9.9
  Top Layer w0.254: 7.1,13 7.48,12.62 9.71,12.62 11.69,10.64 11.69,10.61 11.95,10.36 11.98,10.36 12.05,10.29 U1.59 ; 7.1,13 6.54,12.45 GH1.2 ; 7.1,13 7.1,13.86 D1.6
U3_RX: length 9.9
  Top Layer w0.254: v1(7.75,19.54) 7.75,15.91 8.11,15.54 8.96,15.54 11.21,13.29 U1.53
U3_TX: length 16.2
  Top Layer w0.254: GH2.2 6.21,20.75 6.84,20.12 6.84,17.74 v1(7.04,17.54) ; v1(8.49,17.58) 8.49,16.71 11.41,13.79 U1.52 ; v1(10.27,17.83) 10.67,18.23 10.67,19.52
  Bottom Layer w0.254: v1(7.04,17.54) 8.46,17.54 v1(8.49,17.58) 10.02,17.58 v1(10.27,17.83)
VREF3.3: length 124.3
  Top Layer w0.254: 24.47,13.29 25.8,13.29 26.53,14.02 C11.1 27.07,13.93 29.31,13.93 30.78,12.45 30.78,12.05 ; v1(36.21,10.44) 36.21,11.32 34.91,12.62 31.35,12.62 30.78,12.05 ; 30.78,12.05 U24.2
  Inner1 w0.254: v1(36.21,10.44) 37.07,11.3 37.9,11.3 38,11.4 46.82,11.4 52.28,16.86 52.36,16.86 52.39,16.89 60.05,16.89 61.63,18.47 v1(61.73,18.47) 61.73,29.18 60.93,29.99 60.93,48.01 v1(60.82,48.12) ; v1(27.03,14.02) 17.71,14.02 7.86,23.87 v1(7.86,35.05)
  Bottom Layer w0.254: v1(60.82,48.12) 60.55,48.39 U25.6 ; v1(7.86,35.05) 9.91,35.05 10.45,35.59 10.45,35.94 10.49,35.98 10.49,37.29 C87.1 10.9,37.98 U29.6 ; U27.6 61.25,21.97 61.65,21.56 61.65,18.55 v1(61.73,18.47)

## Copper pours and planes (outline as drawn; the poured copper is in the pictures)
24V on Top Layer: 51.46,54.3 53.7,54.3 54.32,53.68 54.32,49.22 55.6,47.94 55.6,29.66 54.21,28.27 54.21,24.48 53.98,24.25 52.44,24.25 52.13,24.56 51.46,24.56 51.31,24.72 50.25,24.72 48.4,26.56 47.39,26.56 46.47,27.48 46.47,31.67 46.59,31.8 47.47,31.8 50.4,34.73 50.4,53.25
24V on Top Layer: 67.36,7.24 67.38,7.39 67.43,7.56 67.53,7.71 67.65,7.84 67.8,7.93 67.97,7.99 68.12,8 71.05,8 71.21,7.99 71.37,7.93 71.52,7.84 71.65,7.71 71.74,7.56 71.8,7.39 71.81,7.24 71.81,6.75 71.8,6.59 71.74,6.43 71.65,6.28 71.52,6.15 71.37,6.06 71.21,6 71.05,5.99 68.12,5.99 67.97,6 67.8,6.06 67.65,6.15 67.53,6.28 67.43,6.43 67.38,6.59 67.36,6.75
GND on Top Layer: -9.92,65.96 86.09,65.96 86.09,-3.25 -9.92,-3.25
GND on Bottom Layer: -8.27,59.74 84.18,59.74 84.18,-3.25 -8.27,-3.25
GND on Inner1: 9.64,58.09 9.64,25.7 16.41,18.93 58.3,18.93 59.29,19.92 59.29,45.14 62.58,48.44 73.01,48.44 73.01,56.31 73.52,56.82 72.25,58.09
GND on Inner1: -3.74,58.7 82.95,58.7 82.95,-0.76 -3.74,-0.76
GND on Inner2: -2.81,59.23 85.45,59.23 85.45,-3.63 -2.81,-3.63
$C20_1 on Top Layer: 38.21,34.59 44.43,34.59 45.07,33.83 45.07,28.24 43.8,28.24 43.29,27.74 43.29,26.34 37.68,26.34 37.29,26.72 37.29,33.55 37.58,33.83 37.58,33.96
$C20_1 on Bottom Layer: 38.21,34.59 44.43,34.59 45.07,33.83 45.07,29.51 44.31,28.75 37.68,28.75 37.29,29.14 37.29,33.55 37.58,33.83 37.58,33.96
$C33_1 on Top Layer: 34.49,34.05 33.89,34.78 28.56,34.78 27.87,34.46 26.05,33.07 24.75,33.07 24.24,32.56 24.24,29.01 24.11,28.88 25.98,28.88 27.54,27.31 27.54,26.72 30.05,26.72 34.49,31.16
$C33_1 on Bottom Layer: 24.75,28.66 24.88,28.79 24.88,31 24.9,30.98 27.35,31.42 27.57,31.42 27.8,31.58 27.8,33.23 28.05,33.48 28.05,34.41 28.48,34.84 33.39,34.84 34.41,33.83 34.41,32.23 30.46,28.28 25.13,28.28
$C35_2 on Top Layer: 53.03,11.39 53.32,11.1 53.32,8.67 54.21,7.78 54.21,3.23 53.83,2.84 50.49,2.84 50.14,3.19 50.14,4.11 51.84,5.81 51.84,7.65 51.31,8.18 50.4,8.18 50,8.58 50,10.86 50.54,11.39
$C35_2 on Bottom Layer: 50.78,11.23 56.24,11.23 56.37,11.1 56.37,9.44 54.58,9.44 53.2,8.05 53.2,7.8 53.02,7.62 48.89,7.62 48.89,8.74 49.2,9.05 50.67,9.05 50.78,9.16
$C57_2 on Top Layer: 65.77,20.69 65.78,20.84 65.84,21.01 65.93,21.16 66.06,21.29 66.21,21.38 66.38,21.43 66.53,21.45 70.12,21.45 70.27,21.43 70.44,21.38 70.59,21.29 70.72,21.16 70.81,21.01 70.87,20.84 70.88,20.69 70.88,20.32 70.87,20.16 70.81,20 70.72,19.85 70.59,19.72 70.44,19.63 70.27,19.57 70.12,19.56 66.53,19.56 66.38,19.57 66.21,19.63 66.06,19.72 65.93,19.85 65.84,20 65.78,20.16 65.77,20.32
$C57_2 on Top Layer: 64.25,24.18 64.26,24.33 64.32,24.5 64.41,24.65 64.53,24.78 64.69,24.87 64.85,24.93 65.01,24.94 66.15,24.94 66.3,24.93 66.47,24.87 66.62,24.78 66.75,24.65 66.84,24.5 66.9,24.33 66.91,24.18 66.91,16.18 66.9,16.03 66.84,15.86 66.75,15.71 66.62,15.58 66.47,15.49 66.3,15.43 66.15,15.42 65.01,15.42 64.85,15.43 64.69,15.49 64.53,15.58 64.41,15.71 64.32,15.86 64.26,16.03 64.25,16.18
$D7_2 on Top Layer: 43.54,27.72 43.5,26.65 43.84,25.18 45.76,25.12 46.09,25.92 45.95,27.4 45.21,28.06 43.85,27.92
$D7_2 on Bottom Layer: 43.65,27.47 43.97,26.43 44.48,25.12 45.58,25.18 45.43,27.79 44.73,27.92 43.85,27.92
$D13_2 on Top Layer: 24.72,33.93 25,34.21 25,34.76 26.96,34.76 27.35,34.36 27.35,33.14 26.99,32.77 24.92,32.77 24.72,32.98
$D13_2 on Bottom Layer: 24.62,33.84 25,34.22 25,34.93 26.71,34.93 27.35,34.29 27.35,33.15 26.99,32.78 24.92,32.78 24.62,33.08
CAP_FRONT on Top Layer: 15.22,41.88 16.93,37.71 18.87,35.75 22.46,34.8 23.88,33.34 11.91,32.95
CHASSIS_CURRENT on Top Layer: 57.84,24.18 57.77,24.74 57.77,28.38 59.91,31.9 60.61,34.1 61.58,37.52 62.22,40.44 64.83,43.05 69.76,43.05 71.36,42.72 76.95,42.21 78.72,40.44 78.72,37.52 77.45,36.25 71.6,35.61 70.47,35.61 68.94,34.72 67.8,34.72 65.64,32.56 65.64,29.64 60.16,24.18

Small or netless copper shapes (teardrops, artwork), in the pictures only: 238 on Top Layer, 299 on Bottom Layer, 36 on Inner1

## Text on the board
Bottom Layer: Design By LL | copyright © IMCA
Bottom Silkscreen Layer: 2025-4-23 | RoboMaster | 超电V2.3
